# EAGLE design atommc3-th (EAGLE 9.6.2)
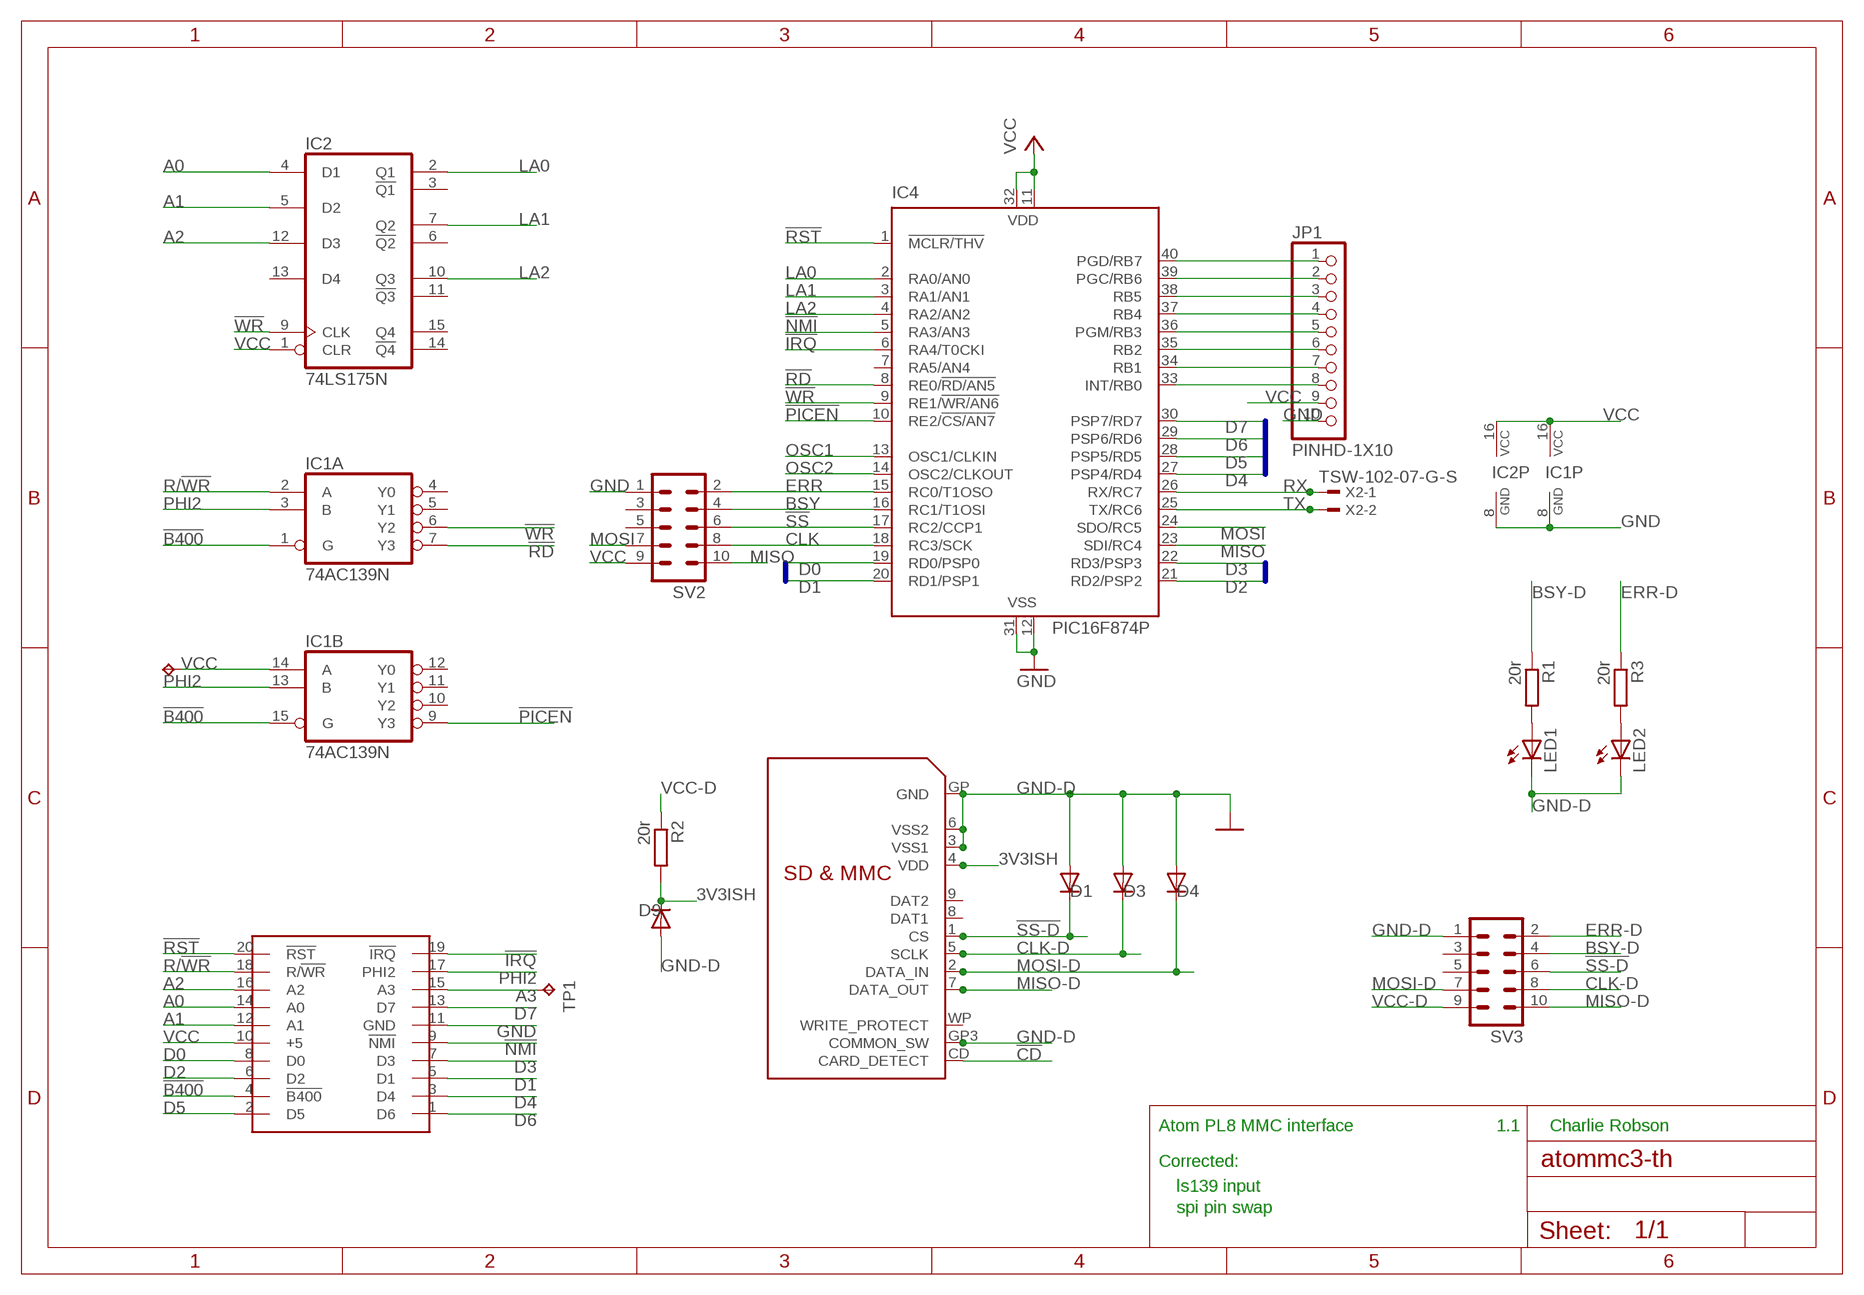
[diagram p0: schematic, sheet 1]

## Parts
D1  3v3 zener  DIODE_E-DO35-7  [DIODE_DO35-7]
D3  3v3 zener  DIODE_E-DO35-7  [DIODE_DO35-7]
D4  3v3 zener  DIODE_E-DO35-7  [DIODE_DO35-7]
D9  3v3 zener  DIODE_E-DO35-7  [DIODE_DO35-7]
IC1  74AC139N  [DIL16]
IC2  74LS175N  [DIL16]
IC4  PIC16F874P  [DIL40]
JP1  PINHD-1X10  [1X10-BIG]
LED1  LED3MM  [LED3MM]
LED2  LED3MM  [LED3MM]
R1  20r  R-EU_0207/10  [0207/10]
R2  20r  R-EU_0207/10  [0207/10]
R3  20r  R-EU_0207/10  [0207/10]
SV2  ML10  [ML10]
SV3  ML10  [ML10]
TP1  TPB1,27  [B1,27]
TP2  TPB1,27  [B1,27]
U$1  PL8-HEADER-MALE  [HEADER-M]
U$4  SDMMC06132-MOD  [06132-MOD]
X2  TSW-102-07-G-S  [TSW-102-XX-G-S]

## Nets
3V3ISH: D9.C(A) R2.2 U$4.4(VDD)
!B400: IC1.1(A:G) IC1.15(B:G) U$1.4(!B400)
!CD: U$4.CD(CARD_DETECT)
!IRQ: IC4.6(RA4/T0CKI) U$1.19(!IRQ)
!NMI: IC4.5(RA3/AN3) U$1.9(!NMI)
!PICEN: IC1.9(B:Y3) IC4.10(RE2/!CS/AN7)
!RD: IC1.7(A:Y3) IC4.8(RE0/!RD/AN5)
!RST: IC4.1(!MCLR/THV) U$1.20(!RST)
!SS: IC4.17(RC2/CCP1) SV2.6
!SS-D: D1.C(A) SV3.6 U$4.1(CS)
!WR: IC1.6(A:Y2) IC2.9(CLK) IC4.9(RE1/!WR/AN6)
A0: IC2.4(D1) U$1.14(A0)
A1: IC2.5(D2) U$1.12(A1)
A2: IC2.12(D3) U$1.16(A2)
A3: TP1.TP U$1.15(A3)
BSY: IC4.16(RC1/T1OSI) SV2.4
BSY-D: R1.1 SV3.4
CLK: IC4.18(RC3/SCK) SV2.8
CLK-D: D3.C(A) SV3.8 U$4.5(SCLK)
D0: IC4.19(RD0/PSP0) U$1.8(D0)
D1: IC4.20(RD1/PSP1) U$1.5(D1)
D2: IC4.21(RD2/PSP2) U$1.6(D2)
D3: IC4.22(RD3/PSP3) U$1.7(D3)
D4: IC4.27(PSP4/RD4) U$1.3(D4)
D5: IC4.28(PSP5/RD5) U$1.2(D5)
D6: IC4.29(PSP6/RD6) U$1.1(D6)
D7: IC4.30(PSP7/RD7) U$1.13(D7)
ERR: IC4.15(RC0/T1OSO) SV2.2
ERR-D: R3.1 SV3.2
GND: IC1.8(P:GND) IC2.8(GND) IC4.12(VSS) IC4.31(VSS) JP1.10 SV2.1 U$1.11(GND)
GND-D: D1.A(C) D3.A(C) D4.A(C) D9.A(C) LED1.K(C) LED2.K(C) SV3.1 U$4.3(VSS1) U$4.6(VSS2) U$4.GP3(COMMON_SW) U$4.GP(GND) ; supply symbol labelled GND
LA0: IC2.2(Q1) IC4.2(RA0/AN0)
LA1: IC2.7(Q2) IC4.3(RA1/AN1)
LA2: IC2.10(Q3) IC4.4(RA2/AN2)
MISO: IC4.23(SDI/RC4) SV2.10
MISO-D: SV3.10 U$4.7(DATA_OUT)
MOSI: IC4.24(SDO/RC5) SV2.7
MOSI-D: D4.C(A) SV3.7 U$4.2(DATA_IN)
N$1: IC4.40(PGD/RB7) JP1.1
N$2: IC4.39(PGC/RB6) JP1.2
N$3: IC4.38(RB5) JP1.3
N$4: IC4.37(RB4) JP1.4
N$5: IC4.36(PGM/RB3) JP1.5
N$6: IC4.35(RB2) JP1.6
N$7: IC4.34(RB1) JP1.7
N$8: IC4.33(INT/RB0) JP1.8
N$9: LED1.A R1.2
N$10: LED2.A R3.2
OSC1: IC4.13(OSC1/CLKIN)
OSC2: IC4.14(OSC2/CLKOUT)
PHI2: IC1.3(A:B) IC1.13(B:B) U$1.17(PHI2)
R/!WR: IC1.2(A:A) U$1.18(R/!WR)
RX: IC4.26(RX/RC7) X2.1
TX: IC4.25(TX/RC6) X2.2
VCC: IC1.14(B:A) IC1.16(P:VCC) IC2.1(CLR) IC2.16(VCC) IC4.11(VDD) IC4.32(VDD) JP1.9 SV2.9 TP2.TP U$1.10(+5)
VCC-D: R2.1 SV3.9
Unconnected: IC1.4(A:Y0) IC1.5(A:Y1) IC1.10(B:Y2) IC1.11(B:Y1) IC1.12(B:Y0) IC2.3(!Q1) IC2.6(!Q2) IC2.11(!Q3) IC2.13(D4) IC2.14(!Q4) IC2.15(Q4) IC4.7(RA5/AN4) SV2.3 SV2.5 SV3.3 SV3.5 U$4.8(DAT1) U$4.9(DAT2) U$4.WP(WRITE_PROTECT)

## Buses
D[0..7]

## Notes on the sheet
- Atom PL8 MMC interface | 1.1 | Charlie Robson
- Corrected:
- ls139 input
- spi pin swap

## Library data of the parts
D1 D3 D4 D9 = eagle-ltspice:DIODE_E-: Schottky Diode; SPICEMODEL: diode; SPICEPREFIX: D
IC1 = 74xx-eu:74*139: Dual 2-line to 4-line DECODER/DEMULTIPLEXER
IC2 = 74xx-eu:74*175: Qadruple D type FLIP FLOP, clear
IC4 = microchip:PIC16F87*: MICROCONTROLLER
JP1 = adafruit:PINHD-1X10: Pin header 1x10 0.1" spacing With round pins
LED1 LED2 = adafruit:LED: LED OSRAM: - CHIPLED LG R971, LG N971, LY N971, LG Q971, LY Q971, LO R971, LY R971 LH N974, LH R974 LS Q976, LO Q976, LY Q976 LO Q996 - Hyper CHIPLED LW Q18S LB Q993, LB Q99A, LB R99A - SideLED LS A670, LO A670, LY A670, LG A670, LP A670 LB A673, LV A673, LT A673, LW A673 LH A674 LY A675 LS A676, LA A676, LO A676, LY A676, LW A676 LS A679, LY A679, LG A679 - Hyper Micro SIDELED® LS Y876, LA Y876, LO Y876, LY Y876 LT Y87S - SmartLED LW L88C, LW L88S LB L89C, LB L89S, LG L890 LS L89K, LO L89K, LY L89K LS L896, LA L896, LO L896, LY L896 - TOPLED LS T670, LO T670, LY T670, LG T670, LP T670 LSG T670, LSP T670, LSY T670, LOP T670, LYG T670 LG T671, LOG T671, LSG T671 LB T673, LV T673, LT T673, LW T673 LH T674 LS T676, LA T676, LO T676, LY T676, LB T676, LH T676, LSB T676, LW T676 LB T67C, LV T67C, LT T67C, LS T67K, LO T67K, LY T67K, LW E67C LS E67B, LA E67B, LO E67B, LY E67B, LB E67C, LV E67C, LT E67C LW T67C LS T679, LY T679, LG T679 LS T770, LO T770, LY T770, LG T770, LP T770 LB T773, LV T773, LT T773, LW T773 LH T774 LS E675, LA E675, LY E675, LS T675 LS T776, LA T776, LO T776, LY T776, LB T776 LHGB T686 LT T68C, LB T68C - Hyper Mini TOPLED® LB M676 - Mini TOPLED Santana® LG M470 LS M47K, LO M47K, LY M47K Source: http://www.osram.convergy.de/
R1-R3 = resistor:R-EU_: RESISTOR, European symbol
SV2 SV3 = con-harting-ml:ML10: HARTING
TP1 TP2 = testpad:TP: Test pad
U$1 = atom:PL8-HEADER-MALE
U$4 = adafruit:SDMMC: SD MMC Card holder 4UCON part #06132 - easy to solder
X2 = con-samtec:TSW-102-*-G-S: THROUGH-HOLE .025" SQ POST HEADER Source: Samtec TSW.pdf; MF: Samtec Inc.; MPN: TSW-102-07-G-S

## Board
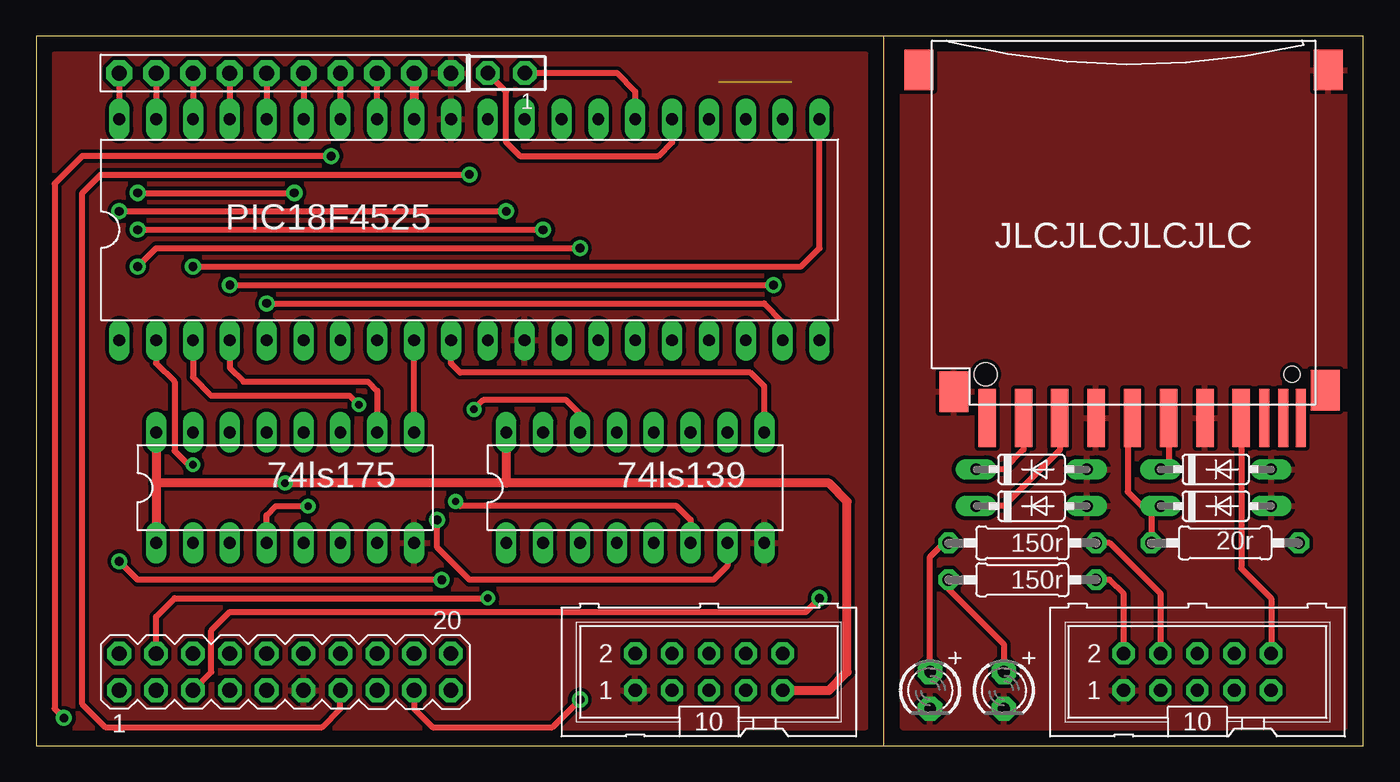
[diagram p1: board, top side]
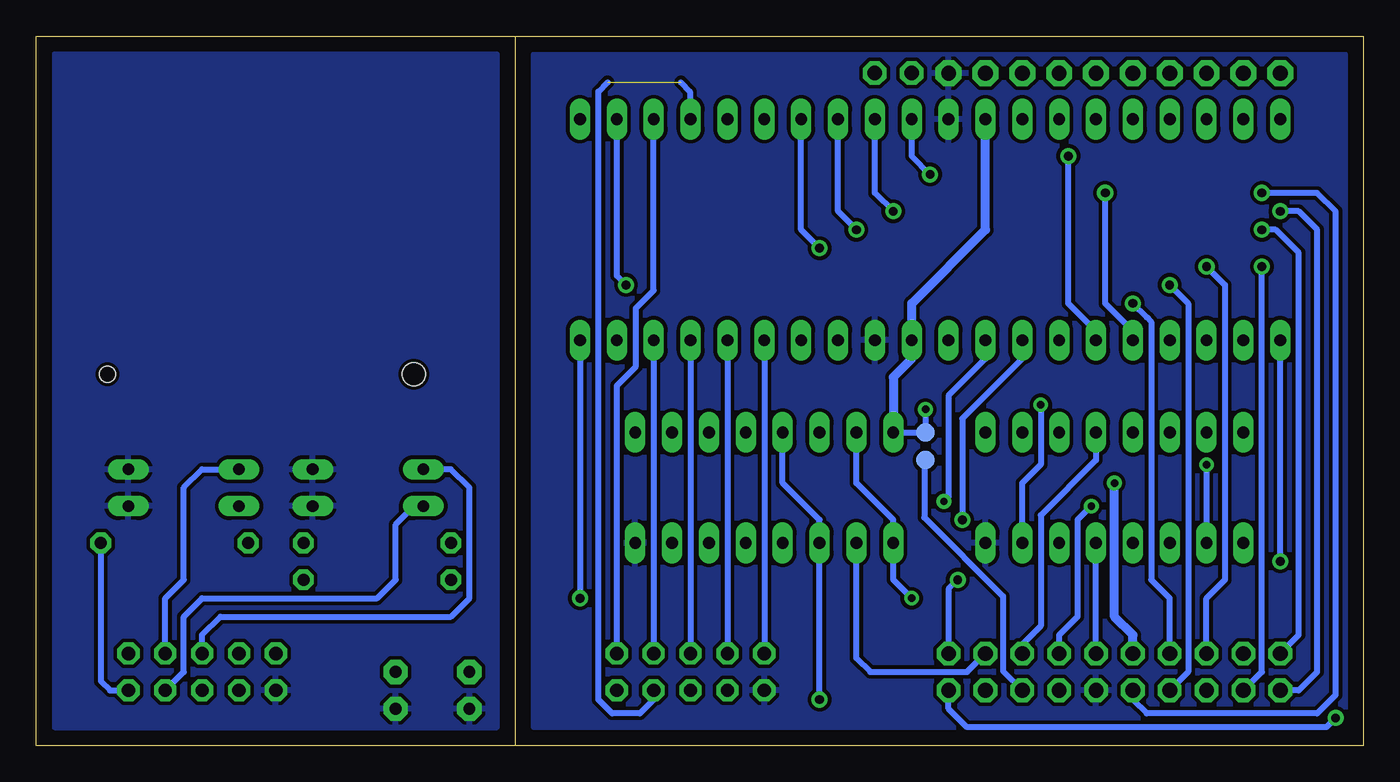
[diagram p2: board, bottom side, seen from below]

Size 91.44 x 48.9 mm. Coordinates in mm from the lower left corner, seen from the top.
Outline: 58.41,0 58.41,48.88
Outline: 0,48.9 0,0 91.44,0 91.44,48.9 0,48.9
Copper layers (1*16): Top 0.035mm / dielectric 1.5mm / Bottom 0.035mm
Design rules "SparkFun": minimum track width 8mil, minimum drill 20mil, track to track 8mil, track to pad 8mil, pad to pad 8mil, via to via 8mil, smd to smd 8mil, copper to edge 10mil, drill to drill 8mil, minimum pad ring 12mil, minimum via ring 10mil, stop-mask expansion 4mil, vias tented up to drill 25mil, thermal gap 10mil

### Footprints (pad centres in the part's own frame; a part is rotated, then mirrored left to right if it is on the bottom)
DIODE_DO35-7 = drill 0.813 long: A 3.81,0; C -3.81,0
DIL16 = drill 0.813 long: 1 -8.89,-3.81; 2 -6.35,-3.81; 3 -3.81,-3.81; 4 -1.27,-3.81; 5 1.27,-3.81; 6 3.81,-3.81; 7 6.35,-3.81; 8 8.89,-3.81; 9 8.89,3.81; 10 6.35,3.81; 11 3.81,3.81; 12 1.27,3.81; 13 -1.27,3.81; 14 -3.81,3.81; 15 -6.35,3.81; 16 -8.89,3.81
DIL40 = drill 0.813 long: 1 -24.13,-7.62; 2 -21.59,-7.62; 3 -19.05,-7.62; 4 -16.51,-7.62; 5 -13.97,-7.62; 6 -11.43,-7.62; 7 -8.89,-7.62; 8 -6.35,-7.62; 9 -3.81,-7.62; 10 -1.27,-7.62; 11 1.27,-7.62; 12 3.81,-7.62; 13 6.35,-7.62; 14 8.89,-7.62; 15 11.43,-7.62; 16 13.97,-7.62; 17 16.51,-7.62; 18 19.05,-7.62; 19 21.59,-7.62; 20 24.13,-7.62; 21 24.13,7.62; 22 21.59,7.62; 23 19.05,7.62; 24 16.51,7.62; 25 13.97,7.62; 26 11.43,7.62; 27 8.89,7.62; 28 6.35,7.62; 29 3.81,7.62; 30 1.27,7.62; 31 -1.27,7.62; 32 -3.81,7.62; 33 -6.35,7.62; 34 -8.89,7.62; 35 -11.43,7.62; 36 -13.97,7.62; 37 -16.51,7.62; 38 -19.05,7.62; 39 -21.59,7.62; 40 -24.13,7.62
1X10-BIG = drill 1.016 pad 1.778 octagon: 1 -11.43,0; 2 -8.89,0; 3 -6.35,0; 4 -3.81,0; 5 -1.27,0; 6 1.27,0; 7 3.81,0; 8 6.35,0; 9 8.89,0; 10 11.43,0
LED3MM = drill 0.813 pad 1.676 octagon: A -1.27,0; K 1.27,0
0207/10 = drill 0.813 octagon: 1 -5.08,0; 2 5.08,0
ML10 = drill 0.914 octagon: 1 -5.08,-1.27; 2 -5.08,1.27; 3 -2.54,-1.27; 4 -2.54,1.27; 5 0,-1.27; 6 0,1.27; 7 2.54,-1.27; 8 2.54,1.27; 9 5.08,-1.27; 10 5.08,1.27
B1,27 = smd 1.27 x 1.27: TP 0,0
HEADER-M = drill 1.016 octagon: 1 -11.43,-1.27; 2 -11.43,1.27; 3 -8.89,-1.27; 4 -8.89,1.27; 5 -6.35,-1.27; 6 -6.35,1.27; 7 -3.81,-1.27; 8 -3.81,1.27; 9 -1.27,-1.27; 10 -1.27,1.27; 11 1.27,-1.27; 12 1.27,1.27; 13 3.81,-1.27; 14 3.81,1.27; 15 6.35,-1.27; 16 6.35,1.27; 17 8.89,-1.27; 18 8.89,1.27; 19 11.43,-1.27; 20 11.43,1.27
06132-MOD = smd 1.2 x 4: 1 6.9,13.6; 2 4.4,13.6; 3 1.9,13.6; 4 -0.6,13.6; 5 -3.1,13.6; 6 -5.6,13.6; 7 -8.1,13.6; 9 9.4,13.6 | smd 0.7 x 4: 8 -9.7,13.6; CD -11,13.6; WP -12.2,13.6 | smd 2 x 2.8: GP -14.117,-10.37; GP2 14.1,-10.37; GP3 11.7,11.8; GP4 -13.9,11.7 | hole 1.1: -11.6,10.6 | hole 1.6: 9.5,10.6
TSW-102-XX-G-S = drill 1 pad 1.5 octagon: 1 1.27,0; 2 -1.27,0

### Placement (x,y rotation side)
D1  68.58,19.05 0 top
D3  81.28,19.05 0 top
D4  68.58,16.51 0 top
D9  81.28,16.51 0 top
IC1  41.27,17.78 0 top
IC2  17.14,17.78 0 top
IC4  29.84,35.56 0 top
JP1  17.14,46.35 0 top
LED1  61.59,3.81 270 top
LED2  66.67,3.81 270 top
R1  67.94,13.97 180 top
R2  81.92,13.97 180 top
R3  67.94,11.43 180 top
SV2  46.35,5.08 0 top
SV3  80.01,5.08 0 top
TP1  30.16,19.68 0 bottom
TP2  30.16,21.59 0 bottom
U$1  17.14,5.08 0 top
U$4  74.93,36.2 180 top
X2  32.38,46.35 0 top

### Tracks (layer width: path | path; a pad name or v marks a point on that pad's centre or on a via)
3V3ISH
  Top 0.406: U$4.4 75.21,22.28 75.21,17.5 76.2,16.51 D9.C 76.83,16.51 R2.2
!B400  (via drill 0.51)
  Top 0.406: U$1.4 8.26,8.89 9.53,10.16 v31.11,10.16
  Bottom 0.406: v31.11,10.16 32.38,11.43 IC1.1 32.38,15.56 34.92,18.1 IC1.15
!IRQ  (via drill 0.6, 0.61)
  Top 0.406: v1.91,1.91 1.27,2.54 1.27,38.73 3.17,40.64 v20.32,40.64
  Bottom 0.406: U$1.19 28.57,2.54 27.3,1.27 2.54,1.27 v1.91,1.91 | IC4.6 18.41,28.57 20.32,30.48 v20.32,40.64
!NMI  (via drill 0.6, 0.61)
  Top 0.406: v6.99,38.1 v17.78,38.1
  Bottom 0.406: U$1.9 15.88,3.17 14.92,2.22 3.17,2.22 1.91,3.49 1.91,36.83 3.17,38.1 v6.99,38.1 | IC4.5 15.88,28.57 17.78,30.48 v17.78,38.1
!PICEN
  Top 0.406: IC1.9 50.16,24.77 49.21,25.72 29.21,25.72 28.57,26.35 IC4.10
!RD  (via drill 0.6)
  Top 0.406: v27.62,15.56 27.62,13.65 29.84,11.43 46.67,11.43 47.62,12.38 IC1.7
  Bottom 0.406: IC4.8 23.5,26.67 27.62,22.54 v27.62,15.56
!RST  (via drill 0.6)
  Top 0.406: v5.71,12.7 6.99,11.43 v27.94,11.43
  Bottom 0.406: v27.94,11.43 28.57,10.79 U$1.20 | v5.71,12.7 IC4.1
!SS
  Bottom 0.406: IC4.17 SV2.6
!SS-D
  Top 0.406: U$4.1 68.03,20.41 66.67,19.05 D1.C
  Bottom 0.406: SV3.6 80.01,7.62 78.74,8.89 62.87,8.89 61.59,10.16 61.59,17.78 62.87,19.05 D1.C
!WR  (via drill 0.51)
  Top 0.406: v28.89,16.83 29.21,16.51 44.13,16.51 45.09,15.56 IC1.6 | IC2.9 IC4.9
  Bottom 0.406: IC4.9 26.04,26.67 28.57,24.13 28.57,17.14 v28.89,16.83
A0  (via drill 0.51)
  Top 0.406: IC2.4 15.88,15.88 16.51,16.51 v18.73,16.51
  Bottom 0.406: U$1.14 20.95,7.62 19.68,8.89 19.68,15.56 v18.73,16.51
A1
  Bottom 0.406: U$1.12 IC2.5
A2
  Bottom 0.406: IC2.12 18.41,19.68 22.23,15.88 22.23,8.26 23.5,6.99 U$1.16
A3
  Bottom 0.406: TP1.TP 30.24,19.68 30.24,15.73 24.82,10.3 24.82,5.13 U$1.15
BSY
  Bottom 0.406: IC4.16 SV2.4
BSY-D
  Top 0.406: R1.1 73.98,13.97 77.47,10.48 SV3.4
CLK
  Bottom 0.406: IC4.18 SV2.8
CLK-D
  Top 0.406: D3.C 78.03,19.61 U$4.5
  Bottom 0.406: D3.C 80.01,19.05 81.28,17.78 81.28,11.43 82.55,10.16 SV3.8
D0  (via drill 0.6)
  Top 0.406: v15.88,30.48 50.16,30.48 51.44,29.21 IC4.19
  Bottom 0.406: U$1.8 13.34,10.16 14.61,11.43 14.61,29.21 14.92,29.53 v15.88,30.48
D1  (via drill 0.61)
  Top 0.406: v53.98,10.16 53.02,9.21 13.34,9.21 12.06,7.94 12.06,5.08 U$1.5
  Bottom 0.406: IC4.20 v53.98,10.16
D2  (via drill 0.6)
  Top 0.406: v10.79,33.02 52.7,33.02 53.98,34.29 IC4.21
  Bottom 0.406: U$1.6 10.79,10.16 9.53,11.43 9.53,31.75 v10.79,33.02
D3  (via drill 0.6)
  Top 0.406: v13.34,31.75 v50.8,31.75
  Bottom 0.406: U$1.7 12.06,5.08 12.06,30.48 v13.34,31.75 | v50.8,31.75 51.44,32.38 IC4.22
D4  (via drill 0.6)
  Top 0.406: v6.99,33.02 8.26,34.29 v37.47,34.29
  Bottom 0.406: U$1.3 6.99,5.08 v6.99,33.02 | v37.47,34.29 38.73,35.56 IC4.27
D5  (via drill 0.6)
  Top 0.406: v6.99,35.56 v34.92,35.56
  Bottom 0.406: U$1.2 4.45,7.62 4.45,33.97 6.03,35.56 v6.99,35.56 | v34.92,35.56 36.2,36.83 IC4.28
D6  (via drill 0.6)
  Top 0.406: v5.71,36.83 v32.38,36.83
  Bottom 0.406: U$1.1 4.45,3.81 3.17,5.08 3.17,35.56 4.45,36.83 v5.71,36.83 | IC4.29 33.66,38.1 v32.38,36.83
D7  (via drill 0.6)
  Top 0.406: U$1.13 20.95,2.54 19.68,1.27 4.76,1.27 3.17,2.86 3.17,38.1 4.45,39.37 v29.84,39.37
  Bottom 0.406: v29.84,39.37 31.11,40.64 IC4.30
ERR
  Bottom 0.406: IC4.15 SV2.2
ERR-D
  Top 0.406: SV3.2 74.93,10.48 73.98,11.43 R3.1
GND
  pour Top (isolate 0.254): 1.27,47.62 1.27,1.27 57.15,1.27 57.15,47.62
  pour Bottom (isolate 0.254): 1.27,47.62 1.27,1.27 57.15,1.27 57.15,47.62
GND-D
  pour Top (isolate 0.254): 59.69,47.62 59.69,1.27 90.17,1.27 90.17,47.62
  pour Bottom (isolate 0.254): 59.69,47.62 90.17,47.62 90.17,1.27 59.69,1.27
LA0  (via drill 0.51)
  Top 0.406: IC4.2 8.26,26.35 9.53,25.08 9.53,20.32 10.48,19.37 v10.79,19.37
  Bottom 0.406: v10.79,19.37 IC2.2
LA1  (via drill 0.51)
  Top 0.406: IC4.3 10.79,25.4 12.06,24.13 21.59,24.13 v22.23,23.5
  Bottom 0.406: IC2.7 23.5,18.1 22.23,19.37 v22.23,23.5
LA2
  Top 0.406: IC4.4 13.34,26.04 14.29,25.08 22.86,25.08 23.5,24.45 IC2.10
MISO
  Bottom 0.406: SV2.10 51.44,24.82 50.12,26.13 50.12,30.15 48.9,31.38 IC4.23
MISO-D
  Top 0.406: SV3.10 85.09,10.16 83.03,12.22 U$4.7
MOSI  (1 unrouted)
  Bottom 0.406: SV2.7 48.9,3.17 49.85,2.22 51.75,2.22 52.7,3.17 52.7,45.09 52.07,45.72 | 47.03,45.72 46.39,45.09 46.39,43.22 IC4.24
MOSI-D
  Top 0.406: U$4.2 70.53,20.36 66.67,16.51 D4.C
  Bottom 0.406: SV3.7 81.28,5.08 81.28,8.89 80.01,10.16 67.94,10.16 66.67,11.43 66.67,15.24 65.41,16.51 D4.C
N$1
  Top 0.406: JP1.1 IC4.40
N$2
  Top 0.406: JP1.2 IC4.39
N$3
  Top 0.406: JP1.3 IC4.38
N$4
  Top 0.406: JP1.4 IC4.37
N$5
  Top 0.406: JP1.5 IC4.36
N$6
  Top 0.406: JP1.6 IC4.35
N$7
  Top 0.406: JP1.7 IC4.34
N$8
  Top 0.406: IC4.33 JP1.8
N$9
  Top 0.406: LED1.A 61.59,13.02 62.55,13.97 R1.2
N$10
  Top 0.406: R3.2 62.87,10.79 66.67,6.99 LED2.A
PHI2  (via drill 0.61)
  Top 0.406: U$1.17 26.04,2.54 27.3,1.27 35.56,1.27 v37.47,3.17
  Bottom 0.406: v37.47,3.17 IC1.3 37.47,15.56 40.01,18.1 IC1.13
R/!WR
  Bottom 0.406: U$1.18 27.3,5.08 33.97,5.08 34.92,6.03 IC1.2
RX
  Top 0.406: IC4.26 41.27,45.09 40.01,46.35 X2.1
TX
  Top 0.406: IC4.25 43.81,41.59 42.86,40.64 33.34,40.64 32.38,41.59 32.38,45.09 X2.2
VCC  (via drill 0.51)
  Top 0.406: IC1.14 37.47,22.86 36.51,23.81 30.8,23.81 v30.16,23.18
  Top 0.61: 32.38,18.1 v17.14,18.1 8.26,18.1 | JP1.9 IC4.32 | SV2.9 54.61,3.81 55.88,5.08 55.88,16.83 54.61,18.1 32.38,18.1 | IC1.16 32.38,18.1 | IC2.16 8.26,18.1 | 8.26,18.1 IC2.1
  Bottom 0.406: v30.16,23.18 TP2.TP IC1.16
  Bottom 0.61: IC4.32 26.04,35.56 31.11,30.48 IC4.11 31.11,26.67 32.38,25.4 IC1.16 | U$1.10 15.88,7.62 17.14,8.89 v17.14,18.1
VCC-D
  Bottom 0.406: R2.1 87,4.45 86.36,3.81 SV3.9

### Text on the board
tPlace: 150r | 20r | 150r
tNames: PIC18F4525 | JLCJLCJLCJLC | 74ls175 | 74ls139